# Altium schematic sheet 0170_IMVP VREG _SOC__ C.SchDoc
size 848 x 558 mm
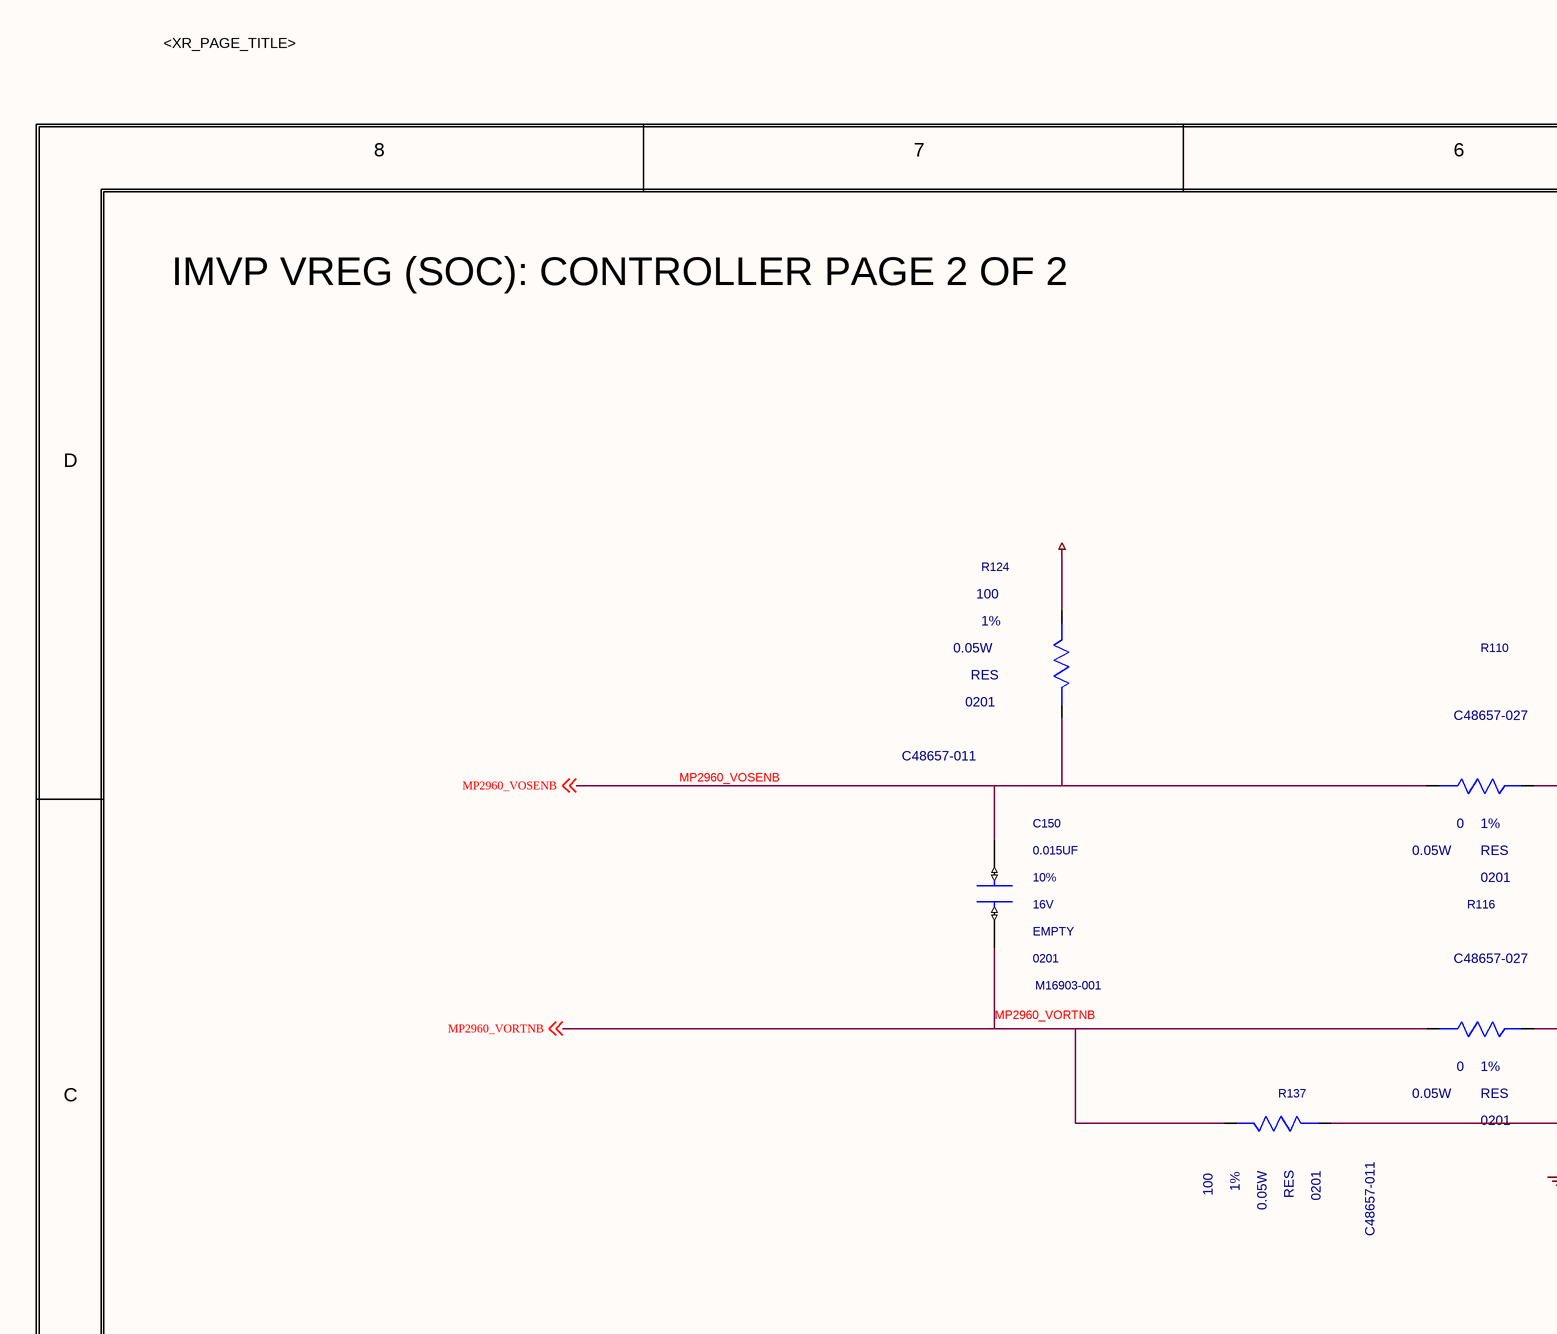
[diagram p0: 0170_IMVP VREG _SOC__ C.SchDoc, top left]
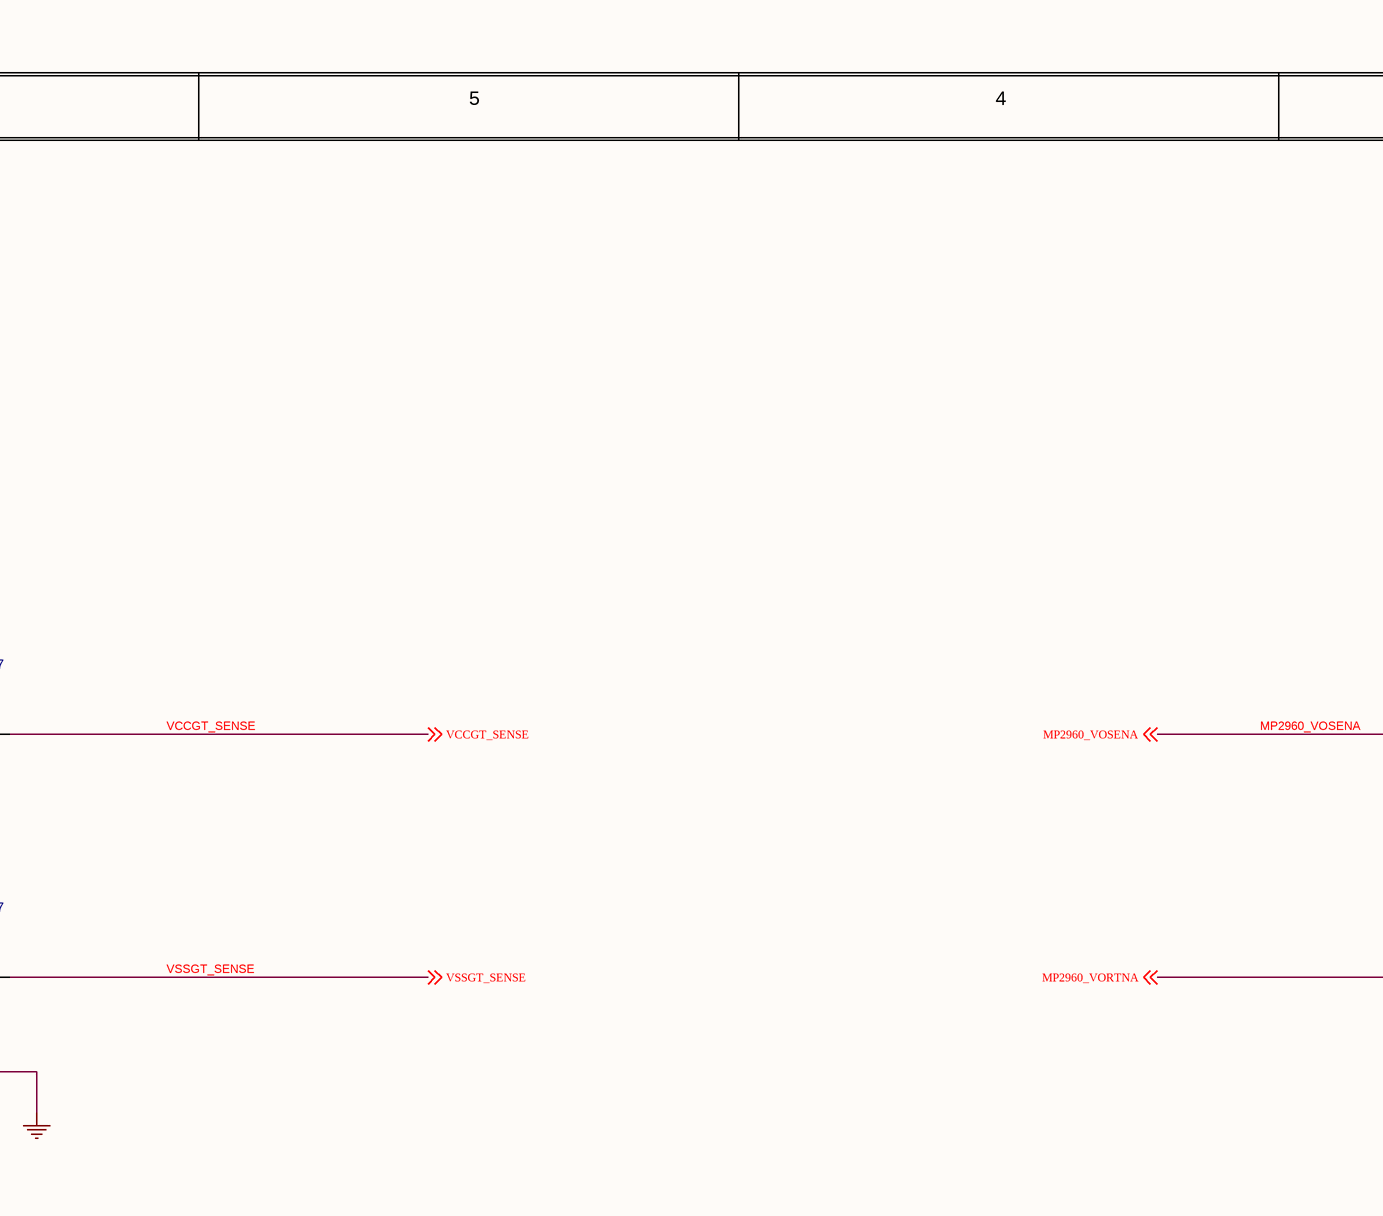
[diagram p1: 0170_IMVP VREG _SOC__ C.SchDoc, top middle]
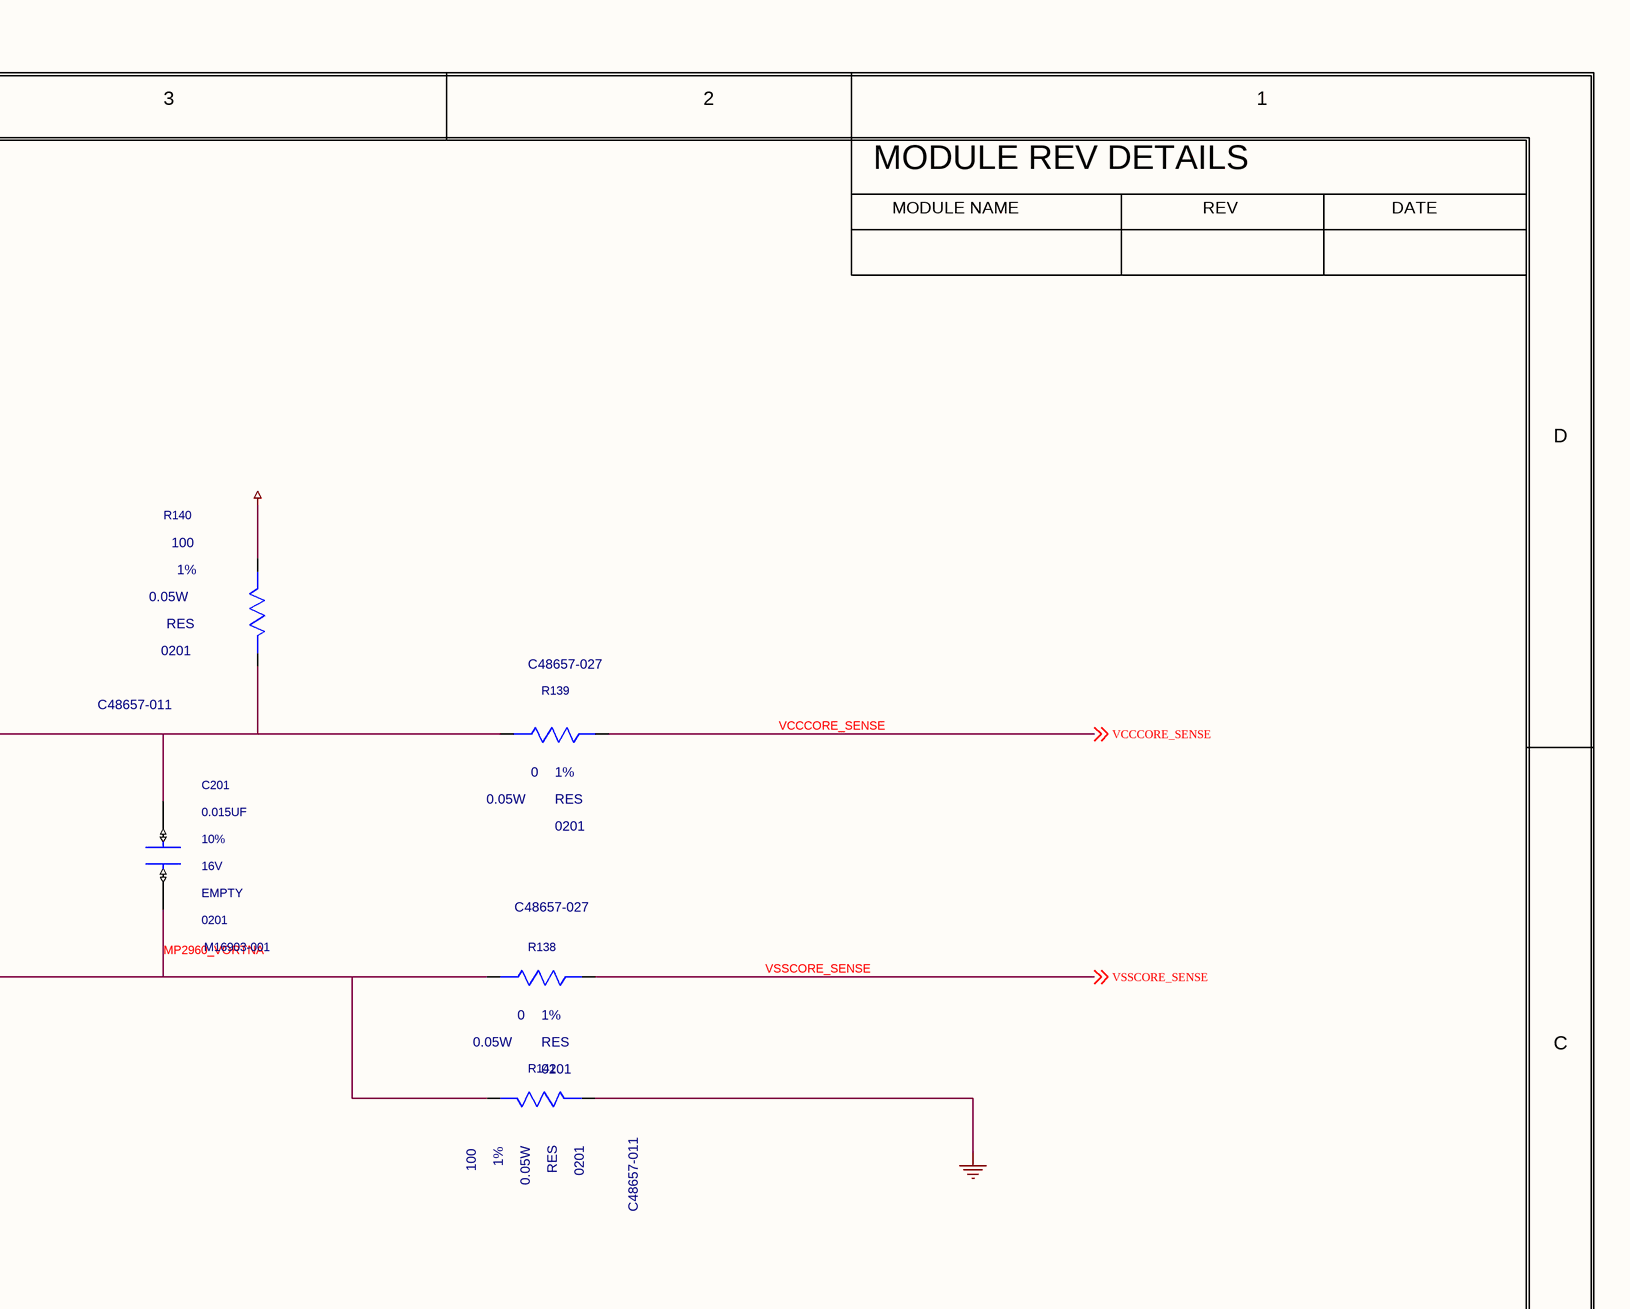
[diagram p2: 0170_IMVP VREG _SOC__ C.SchDoc, top right]
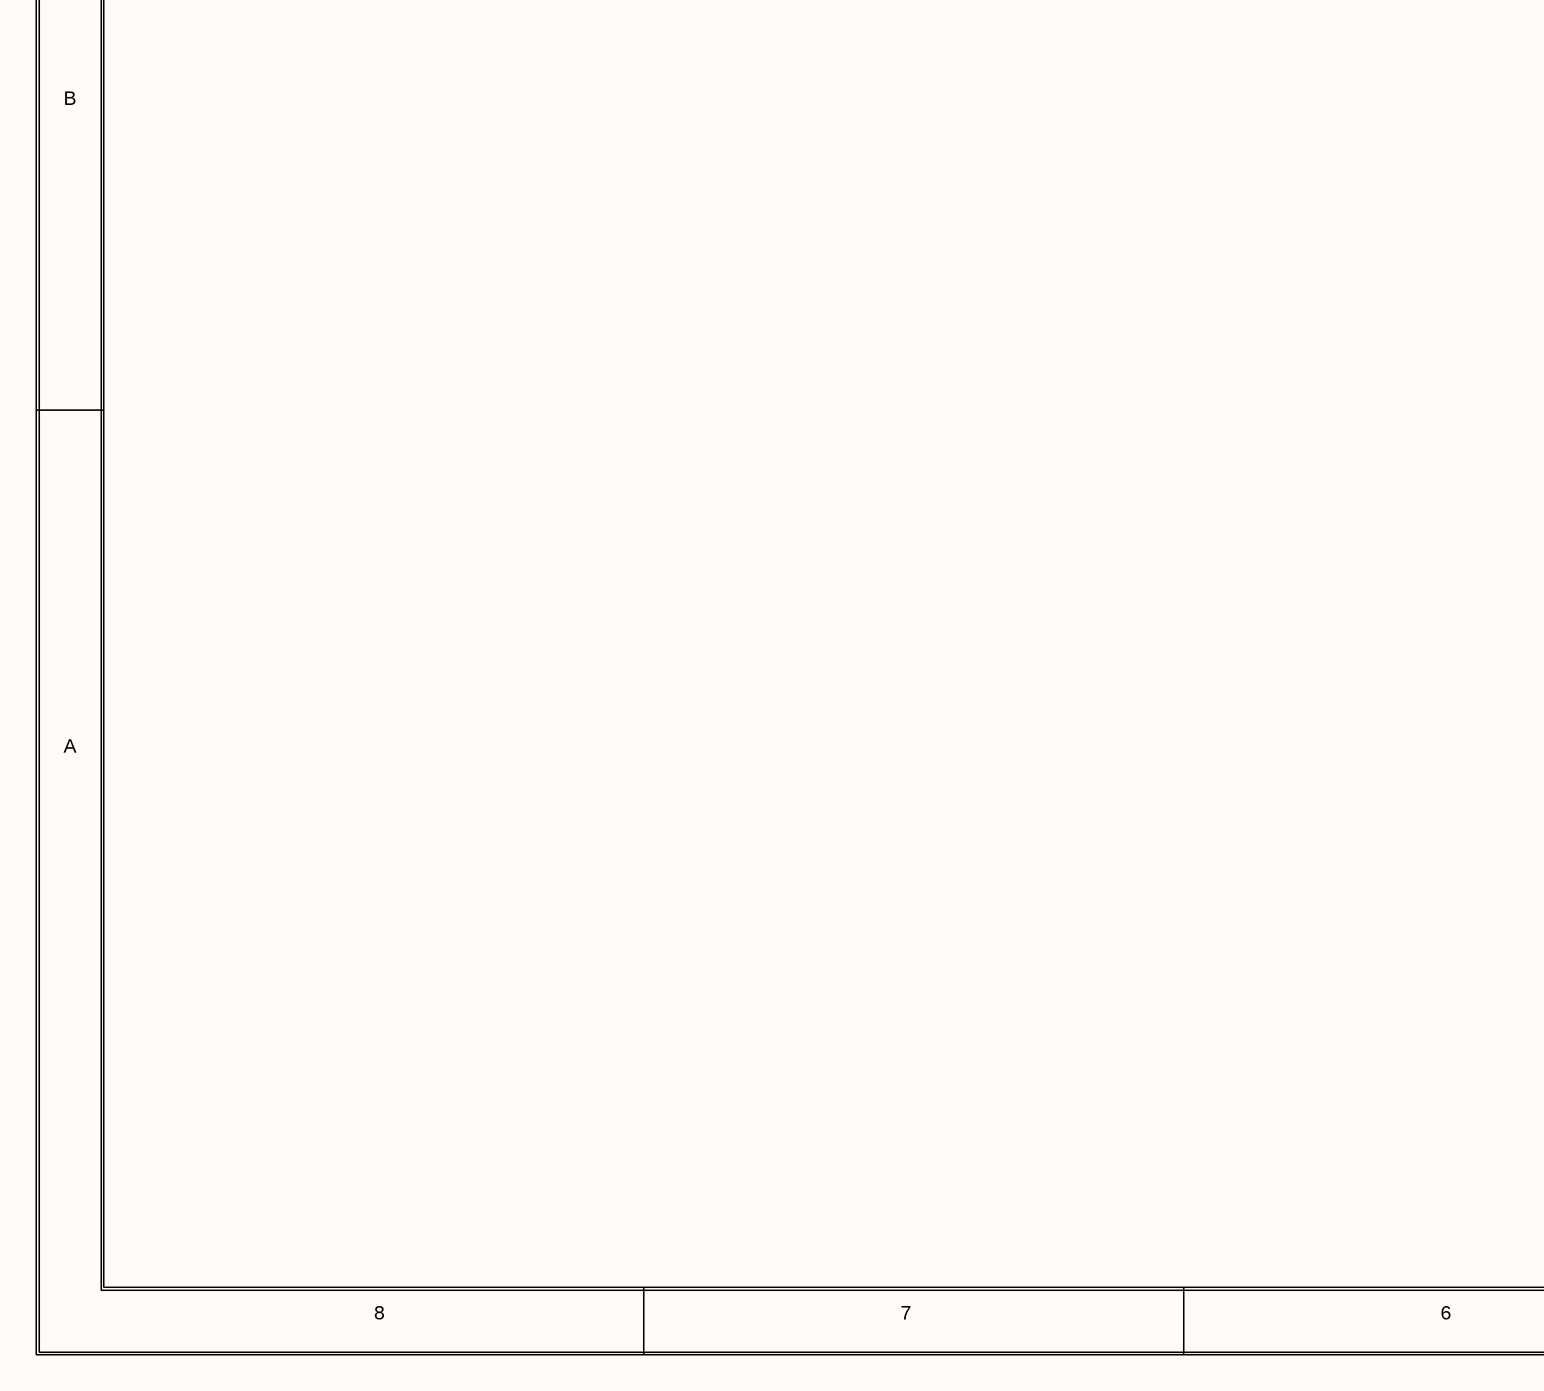
[diagram p3: 0170_IMVP VREG _SOC__ C.SchDoc, bottom left]
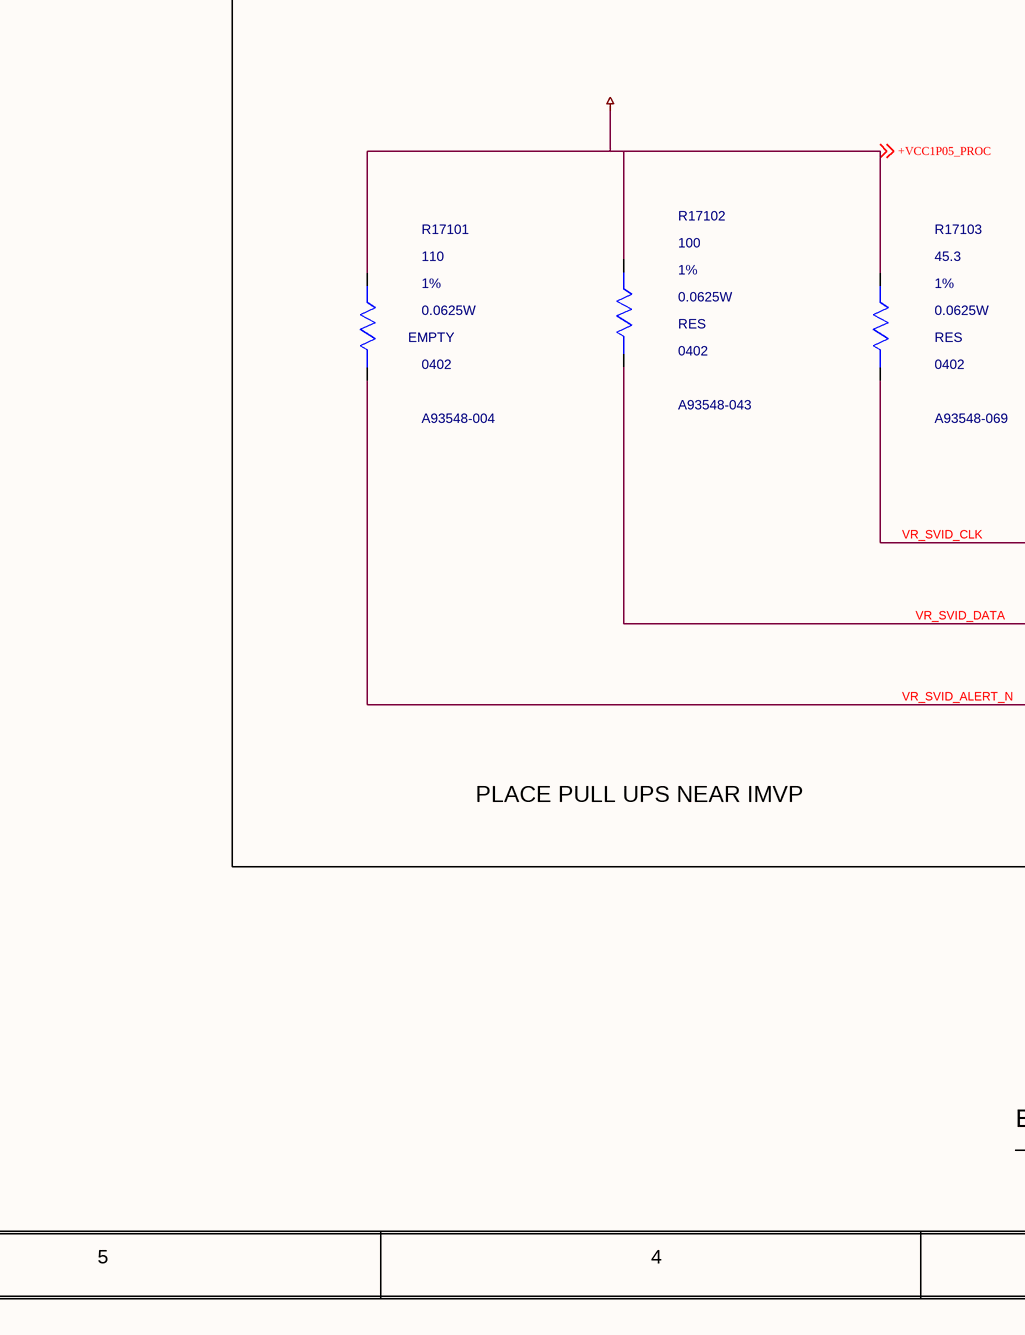
[diagram p4: 0170_IMVP VREG _SOC__ C.SchDoc, bottom middle]
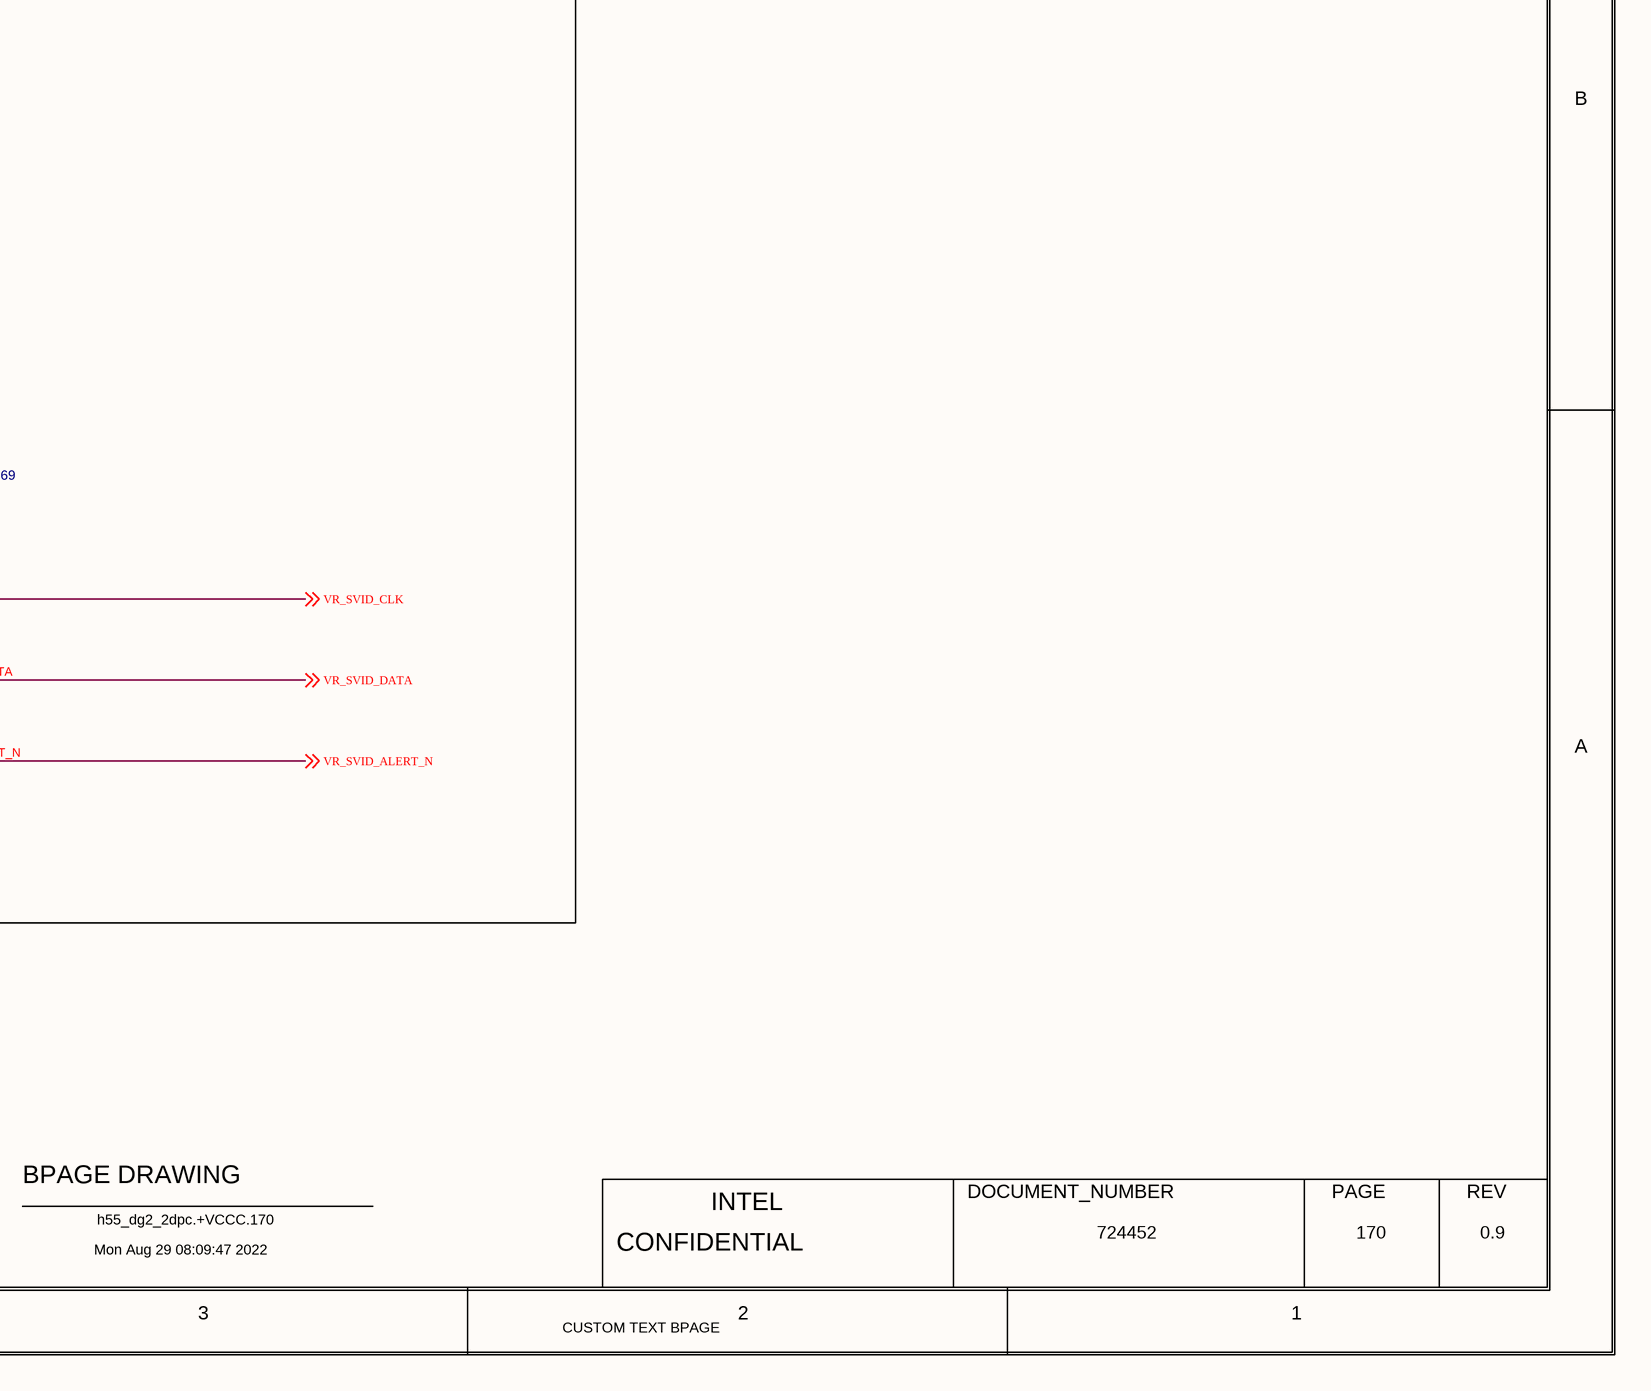
[diagram p5: 0170_IMVP VREG _SOC__ C.SchDoc, bottom right]

## Parts
C150  0.015UF  MATERIAL: EMPTY  PACK_TYPE: 0201  PART_NUMBER: M16903-001  TOLERANCE: 10%  VOLTAGE: 16V  [CTK0_SM0201_630X330_MA]
C201  0.015UF  MATERIAL: EMPTY  PACK_TYPE: 0201  PART_NUMBER: M16903-001  TOLERANCE: 10%  VOLTAGE: 16V  [CTK0_SM0201_630X330_MA]
R110  0  MATERIAL: RES  PACK_TYPE: 0201  PART_NUMBER: C48657-027  TOLERANCE: 1%  WATTAGE: 0.05W  [CTK0_SM0201_630X330_MA]
R116  0  MATERIAL: RES  PACK_TYPE: 0201  PART_NUMBER: C48657-027  TOLERANCE: 1%  WATTAGE: 0.05W  [CTK0_SM0201_630X330_MA]
R124  100  MATERIAL: RES  PACK_TYPE: 0201  PART_NUMBER: C48657-011  TOLERANCE: 1%  WATTAGE: 0.05W  [CTK0_SM0201_630X330_MA]
R137  100  MATERIAL: RES  PACK_TYPE: 0201  PART_NUMBER: C48657-011  TOLERANCE: 1%  WATTAGE: 0.05W  [CTK0_SM0201_630X330_MA]
R138  0  MATERIAL: RES  PACK_TYPE: 0201  PART_NUMBER: C48657-027  TOLERANCE: 1%  WATTAGE: 0.05W  [CTK0_SM0201_630X330_MA]
R139  0  MATERIAL: RES  PACK_TYPE: 0201  PART_NUMBER: C48657-027  TOLERANCE: 1%  WATTAGE: 0.05W  [CTK0_SM0201_630X330_MA]
R140  100  MATERIAL: RES  PACK_TYPE: 0201  PART_NUMBER: C48657-011  TOLERANCE: 1%  WATTAGE: 0.05W  [CTK0_SM0201_630X330_MA]
R141  100  MATERIAL: RES  PACK_TYPE: 0201  PART_NUMBER: C48657-011  TOLERANCE: 1%  WATTAGE: 0.05W  [CTK0_SM0201_630X330_MA]
R17101  110  MATERIAL: EMPTY  PACK_TYPE: 0402  PART_NUMBER: A93548-004  TOLERANCE: 1%  WATTAGE: 0.0625W  [CTK2_SM0402_1100X550_MA]
R17102  100  MATERIAL: RES  PACK_TYPE: 0402  PART_NUMBER: A93548-043  TOLERANCE: 1%  WATTAGE: 0.0625W  [CTK2_SM0402_1100X550_MA]
R17103  45.3  MATERIAL: RES  PACK_TYPE: 0402  PART_NUMBER: A93548-069  TOLERANCE: 1%  WATTAGE: 0.0625W  [CTK2_SM0402_1100X550_MA]

## Blocks framed on the sheet
PLACE PULL UPS NEAR IMVP: R17101-R17103

## Nets
+VCC1P05_PROC: R17101.1(A) R17102.1(A) R17103.1(A) ; off-sheet +VCC1P05_PROC
+VCCCORE: R140.1(A)
+VCCGT: R124.1(A)
GND: R137.2(B) R141.2(B)
MP2960_VORTNA: C201.2(B) R138.1(A) R141.1(A) ; off-sheet MP2960_VORTNA
MP2960_VORTNB: C150.2(B) R116.1(A) R137.1(A) ; off-sheet MP2960_VORTNB
MP2960_VOSENA: C201.1(A) R139.1(A) R140.2(B) ; off-sheet MP2960_VOSENA
MP2960_VOSENB: C150.1(A) R110.1(A) R124.2(B) ; off-sheet MP2960_VOSENB
VCCCORE_SENSE: R139.2(B) ; off-sheet VCCCORE_SENSE
VCCGT_SENSE: R110.2(B) ; off-sheet VCCGT_SENSE
VR_SVID_ALERT_N: R17101.2(B) ; off-sheet VR_SVID_ALERT_N
VR_SVID_CLK: R17103.2(B) ; off-sheet VR_SVID_CLK
VR_SVID_DATA: R17102.2(B) ; off-sheet VR_SVID_DATA
VSSCORE_SENSE: R138.2(B) ; off-sheet VSSCORE_SENSE
VSSGT_SENSE: R116.2(B) ; off-sheet VSSGT_SENSE

## Notes on the sheet
- <XR_PAGE_TITLE>
- 8
- 7
- 6
- 5
- 4
- 3
- 2
- 1
- MODULE REV DETAILS
- IMVP VREG (SOC): CONTROLLER PAGE 2 OF 2
- MODULE NAME
- REV
- DATE
- D
- C
- B
- A
- BPAGE DRAWING
- INTEL
- DOCUMENT_NUMBER
- PAGE
- Mon Aug 29 08:09:47 2022
- h55_dg2_2dpc.+VCCC.170
- CONFIDENTIAL
- 724452
- 170
- 0.9
- CUSTOM TEXT BPAGE

## Library data of the parts
C150 = C_CAP: CDS_PHYS_PART_NAME: C_CAP_0201-M16903-001,EMPTY,0.015UF,16V,10%,TK0,GENERIC; CDS_LMAN_SYM_OUTLINE: -50,50,50,-50; FP_TECH: TK0; IP: GENERIC; ROOM: NONE; OriginalSymbolOrigin: (-50,25); XY: (-1550,3075); VER: 1; ROT: 0; PHYS_PAGE: 170; LOCATION: C150; DRAWING: @RVP1_ADL_SB_ADP_S_DDR5_SODIMM_2DPC_LIB.H55_DG2_2DPC(SCH_1):PAGE539; CDS_LIB: c_discrete; VARIANT: ?; PCB Footprint: CTK0_SM0201_630X330_MA; CHIPS_PART_NAME: C_CAP; CDS_PART_NAME: C_CAP_0201-M16903-001,EMPTY,0.015UF,16V,10%,TK0,GENERIC; CDS_LOCATION: C150
C201 = C_CAP: CDS_PHYS_PART_NAME: C_CAP_0201-M16903-001,EMPTY,0.015UF,16V,10%,TK0,GENERIC; CDS_LMAN_SYM_OUTLINE: -50,50,50,-50; FP_TECH: TK0; IP: GENERIC; ROOM: NONE; OriginalSymbolOrigin: (-50,25); XY: (2275,3050); VER: 1; ROT: 0; PHYS_PAGE: 170; LOCATION: C201; DRAWING: @RVP1_ADL_SB_ADP_S_DDR5_SODIMM_2DPC_LIB.H55_DG2_2DPC(SCH_1):PAGE539; CDS_LIB: c_discrete; VARIANT: ?; PCB Footprint: CTK0_SM0201_630X330_MA; CHIPS_PART_NAME: C_CAP; CDS_PART_NAME: C_CAP_0201-M16903-001,EMPTY,0.015UF,16V,10%,TK0,GENERIC; CDS_LOCATION: C201
R110 = C_RES#1: CHIPS_PART_NAME: C_RES; CDS_PHYS_PART_NAME: C_RES_0201-C48657-027,RES,0,1%,0.05W,TK0,GENERIC; CDS_LMAN_SYM_OUTLINE: -50,50,50,-50; FP_TECH: TK0; IP: GENERIC; ROOM: NONE; OriginalSymbolOrigin: (-75,25); XY: (-650,3275); VER: 1; SUB_ROOM: GPU_VCCIN; PHYS_PAGE: 170; LOCATION: R110; DRAWING: @RVP1_ADL_SB_ADP_S_DDR5_SODIMM_2DPC_LIB.H55_DG2_2DPC(SCH_1):PAGE539; CDS_LIB: c_discrete; VARIANT: ?; PCB Footprint: CTK0_SM0201_630X330_MA; ROT: 0; CDS_PART_NAME: C_RES_0201-C48657-027,RES,0,1%,0.05W,TK0,GENERIC; CDS_LOCATION: R110
R116 = C_RES#1: CHIPS_PART_NAME: C_RES; CDS_PHYS_PART_NAME: C_RES_0201-C48657-027,RES,0,1%,0.05W,TK0,GENERIC; CDS_LMAN_SYM_OUTLINE: -50,50,50,-50; FP_TECH: TK0; IP: GENERIC; ROOM: NONE; OriginalSymbolOrigin: (-75,25); XY: (-650,2825); VER: 1; SUB_ROOM: GPU_VCCIN; PHYS_PAGE: 170; LOCATION: R116; DRAWING: @RVP1_ADL_SB_ADP_S_DDR5_SODIMM_2DPC_LIB.H55_DG2_2DPC(SCH_1):PAGE539; CDS_LIB: c_discrete; VARIANT: ?; PCB Footprint: CTK0_SM0201_630X330_MA; ROT: 0; CDS_PART_NAME: C_RES_0201-C48657-027,RES,0,1%,0.05W,TK0,GENERIC; CDS_LOCATION: R116
R124 = C_RES: CDS_PHYS_PART_NAME: C_RES_0201-C48657-011,RES,100,1%,0.05W,TK0,GENERIC; CDS_LMAN_SYM_OUTLINE: -50,50,50,-50; FP_TECH: TK0; IP: GENERIC; ROOM: NONE; OriginalSymbolOrigin: (-25,75); XY: (-1425,3500); VER: 2; SUB_ROOM: GPU_VCCIN; PHYS_PAGE: 170; LOCATION: R124; DRAWING: @RVP1_ADL_SB_ADP_S_DDR5_SODIMM_2DPC_LIB.H55_DG2_2DPC(SCH_1):PAGE539; CDS_LIB: c_discrete; VARIANT: ?; PCB Footprint: CTK0_SM0201_630X330_MA; ROT: 2; CHIPS_PART_NAME: C_RES; CDS_PART_NAME: C_RES_0201-C48657-011,RES,100,1%,0.05W,TK0,GENERIC; CDS_LOCATION: R124
R137 = C_RES: CDS_PHYS_PART_NAME: C_RES_0201-C48657-011,RES,100,1%,0.05W,TK0,GENERIC; CDS_LMAN_SYM_OUTLINE: -50,50,50,-50; FP_TECH: TK0; IP: GENERIC; ROOM: NONE; OriginalSymbolOrigin: (-25,75); XY: (-1025,2650); VER: 2; SUB_ROOM: GPU_VCCIN; ROT: 3; PHYS_PAGE: 170; LOCATION: R137; DRAWING: @RVP1_ADL_SB_ADP_S_DDR5_SODIMM_2DPC_LIB.H55_DG2_2DPC(SCH_1):PAGE539; CDS_LIB: c_discrete; VARIANT: ?; PCB Footprint: CTK0_SM0201_630X330_MA; CHIPS_PART_NAME: C_RES; CDS_PART_NAME: C_RES_0201-C48657-011,RES,100,1%,0.05W,TK0,GENERIC; CDS_LOCATION: R137
R138 = C_RES#1: CHIPS_PART_NAME: C_RES; CDS_PHYS_PART_NAME: C_RES_0201-C48657-027,RES,0,1%,0.05W,TK0,GENERIC; CDS_LMAN_SYM_OUTLINE: -50,50,50,-50; FP_TECH: TK0; IP: GENERIC; ROOM: NONE; OriginalSymbolOrigin: (-75,25); XY: (2975,2825); VER: 1; SUB_ROOM: GPU_VCCIN; PHYS_PAGE: 170; LOCATION: R138; DRAWING: @RVP1_ADL_SB_ADP_S_DDR5_SODIMM_2DPC_LIB.H55_DG2_2DPC(SCH_1):PAGE539; CDS_LIB: c_discrete; VARIANT: ?; PCB Footprint: CTK0_SM0201_630X330_MA; ROT: 0; CDS_PART_NAME: C_RES_0201-C48657-027,RES,0,1%,0.05W,TK0,GENERIC; CDS_LOCATION: R138
R139 = C_RES#1: CHIPS_PART_NAME: C_RES; CDS_PHYS_PART_NAME: C_RES_0201-C48657-027,RES,0,1%,0.05W,TK0,GENERIC; CDS_LMAN_SYM_OUTLINE: -50,50,50,-50; FP_TECH: TK0; IP: GENERIC; ROOM: NONE; OriginalSymbolOrigin: (-75,25); XY: (3000,3275); VER: 1; SUB_ROOM: GPU_VCCIN; PHYS_PAGE: 170; LOCATION: R139; DRAWING: @RVP1_ADL_SB_ADP_S_DDR5_SODIMM_2DPC_LIB.H55_DG2_2DPC(SCH_1):PAGE539; CDS_LIB: c_discrete; VARIANT: ?; PCB Footprint: CTK0_SM0201_630X330_MA; ROT: 0; CDS_PART_NAME: C_RES_0201-C48657-027,RES,0,1%,0.05W,TK0,GENERIC; CDS_LOCATION: R139
R140 = C_RES: CDS_PHYS_PART_NAME: C_RES_0201-C48657-011,RES,100,1%,0.05W,TK0,GENERIC; CDS_LMAN_SYM_OUTLINE: -50,50,50,-50; FP_TECH: TK0; IP: GENERIC; ROOM: NONE; OriginalSymbolOrigin: (-25,75); XY: (2450,3500); VER: 2; SUB_ROOM: GPU_VCCIN; PHYS_PAGE: 170; LOCATION: R140; DRAWING: @RVP1_ADL_SB_ADP_S_DDR5_SODIMM_2DPC_LIB.H55_DG2_2DPC(SCH_1):PAGE539; CDS_LIB: c_discrete; VARIANT: ?; PCB Footprint: CTK0_SM0201_630X330_MA; ROT: 2; CHIPS_PART_NAME: C_RES; CDS_PART_NAME: C_RES_0201-C48657-011,RES,100,1%,0.05W,TK0,GENERIC; CDS_LOCATION: R140
R141 = C_RES: CDS_PHYS_PART_NAME: C_RES_0201-C48657-011,RES,100,1%,0.05W,TK0,GENERIC; CDS_LMAN_SYM_OUTLINE: -50,50,50,-50; FP_TECH: TK0; IP: GENERIC; ROOM: NONE; OriginalSymbolOrigin: (-25,75); XY: (2975,2600); VER: 2; SUB_ROOM: GPU_VCCIN; ROT: 3; PHYS_PAGE: 170; LOCATION: R141; DRAWING: @RVP1_ADL_SB_ADP_S_DDR5_SODIMM_2DPC_LIB.H55_DG2_2DPC(SCH_1):PAGE539; CDS_LIB: c_discrete; VARIANT: ?; PCB Footprint: CTK0_SM0201_630X330_MA; CHIPS_PART_NAME: C_RES; CDS_PART_NAME: C_RES_0201-C48657-011,RES,100,1%,0.05W,TK0,GENERIC; CDS_LOCATION: R141
R17101 = C_RES: CDS_PHYS_PART_NAME: C_RES_0402-A93548-004,EMPTY,110,1%,0.0625W,TK2,GENERIC; CDS_LMAN_SYM_OUTLINE: -50,50,50,-50; FP_TECH: TK2; IP: GENERIC; ROOM: NONE; OriginalSymbolOrigin: (-25,75); XY: (775,1050); VER: 2; ROT: 0; PHYS_PAGE: 170; LOCATION: R17101; DRAWING: @RVP1_ADL_SB_ADP_S_DDR5_SODIMM_2DPC_LIB.H55_DG2_2DPC(SCH_1):PAGE539; CDS_LIB: c_discrete; VARIANT: ?; PCB Footprint: CTK2_SM0402_1100X550_MA; CHIPS_PART_NAME: C_RES; CDS_PART_NAME: C_RES_0402-A93548-004,EMPTY,110,1%,0.0625W,TK2,GENERIC; CDS_LOCATION: R17101
R17102 = C_RES: CDS_PHYS_PART_NAME: C_RES_0402-A93548-043,RES,100,1%,0.0625W,TK2,GENERIC; CDS_LMAN_SYM_OUTLINE: -50,50,50,-50; FP_TECH: TK2; IP: GENERIC; ROOM: NONE; OriginalSymbolOrigin: (-25,75); XY: (1250,1075); VER: 2; ROT: 0; PHYS_PAGE: 170; LOCATION: R17102; DRAWING: @RVP1_ADL_SB_ADP_S_DDR5_SODIMM_2DPC_LIB.H55_DG2_2DPC(SCH_1):PAGE539; CDS_LIB: c_discrete; VARIANT: ?; PCB Footprint: CTK2_SM0402_1100X550_MA; CHIPS_PART_NAME: C_RES; CDS_PART_NAME: C_RES_0402-A93548-043,RES,100,1%,0.0625W,TK2,GENERIC; CDS_LOCATION: R17102
R17103 = C_RES: CDS_PHYS_PART_NAME: C_RES_0402-A93548-069,RES,45.3,1%,0.0625W,TK2,GENERIC; CDS_LMAN_SYM_OUTLINE: -50,50,50,-50; FP_TECH: TK2; IP: GENERIC; ROOM: NONE; OriginalSymbolOrigin: (-25,75); XY: (1725,1050); VER: 2; ROT: 0; PHYS_PAGE: 170; LOCATION: R17103; DRAWING: @RVP1_ADL_SB_ADP_S_DDR5_SODIMM_2DPC_LIB.H55_DG2_2DPC(SCH_1):PAGE539; CDS_LIB: c_discrete; VARIANT: ?; PCB Footprint: CTK2_SM0402_1100X550_MA; CHIPS_PART_NAME: C_RES; CDS_PART_NAME: C_RES_0402-A93548-069,RES,45.3,1%,0.0625W,TK2,GENERIC; CDS_LOCATION: R17103